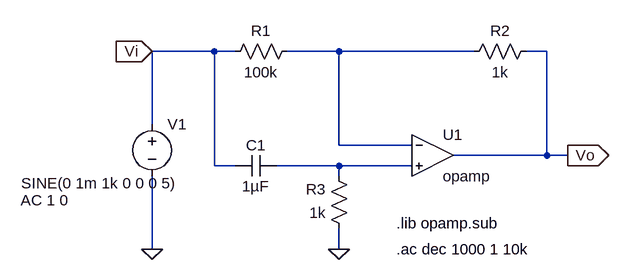
[diagram p0: schematic filtro_pasatodo.asc]
filtro_pasatodo.asc, the LTspice schematic file:
Version 4
SHEET 1 880 680
WIRE -32 -96 -128 -96
WIRE 0 -96 -32 -96
WIRE 160 -96 80 -96
WIRE 368 -96 160 -96
WIRE 480 -96 448 -96
WIRE -128 16 -128 -96
WIRE 160 48 160 -96
WIRE 272 48 160 48
WIRE 480 64 480 -96
WIRE 480 64 336 64
WIRE 512 64 480 64
WIRE -32 80 -32 -96
WIRE 0 80 -32 80
WIRE 160 80 64 80
WIRE 272 80 160 80
WIRE 160 96 160 80
WIRE -128 208 -128 96
WIRE 160 208 160 176
FLAG -128 208 0
FLAG 160 208 0
FLAG 512 64 Vo
IOPIN 512 64 Out
FLAG -128 -96 Vi
IOPIN -128 -96 In
SYMBOL voltage -128 0 R0
WINDOW 3 -201 107 Left 2
WINDOW 123 -202 133 Left 2
WINDOW 39 0 0 Left 0
SYMATTR Value SINE(0 1m 1k 0 0 0 5)
SYMATTR Value2 AC 1 0
SYMATTR InstName V1
SYMBOL res 96 -112 R90
WINDOW 0 0 56 VBottom 2
WINDOW 3 32 56 VTop 2
SYMATTR InstName R1
SYMATTR Value 100k
SYMBOL res 464 -112 R90
WINDOW 0 0 56 VBottom 2
WINDOW 3 32 56 VTop 2
SYMATTR InstName R2
SYMATTR Value 1k
SYMBOL res 176 192 R180
WINDOW 0 36 76 Left 2
WINDOW 3 36 40 Left 2
SYMATTR InstName R3
SYMATTR Value 1k
SYMBOL cap 64 64 R90
WINDOW 0 0 32 VBottom 2
WINDOW 3 32 32 VTop 2
SYMATTR InstName C1
SYMATTR Value 1µF
SYMBOL OpAmps\\opamp 304 0 R0
SYMATTR InstName U1
TEXT 248 168 Left 2 !.lib opamp.sub
TEXT 248 208 Left 2 !.ac dec 1000 1 10k

The netlist it stands for:
* filtro_pasatodo.asc
V1 Vi 0 SINE(0 1m 1k 0 0 0 5) AC 1 0
R1 N001 Vi 100k
R2 Vo N001 1k
R3 0 N002 1k
C1 N002 Vi 1µF
XU1 N001 N002 Vo opamp Aol=100K GBW=10Meg  ; pins invin noninvin out
.lib opamp.sub
.ac dec 1000 1 10k
.backanno
.end